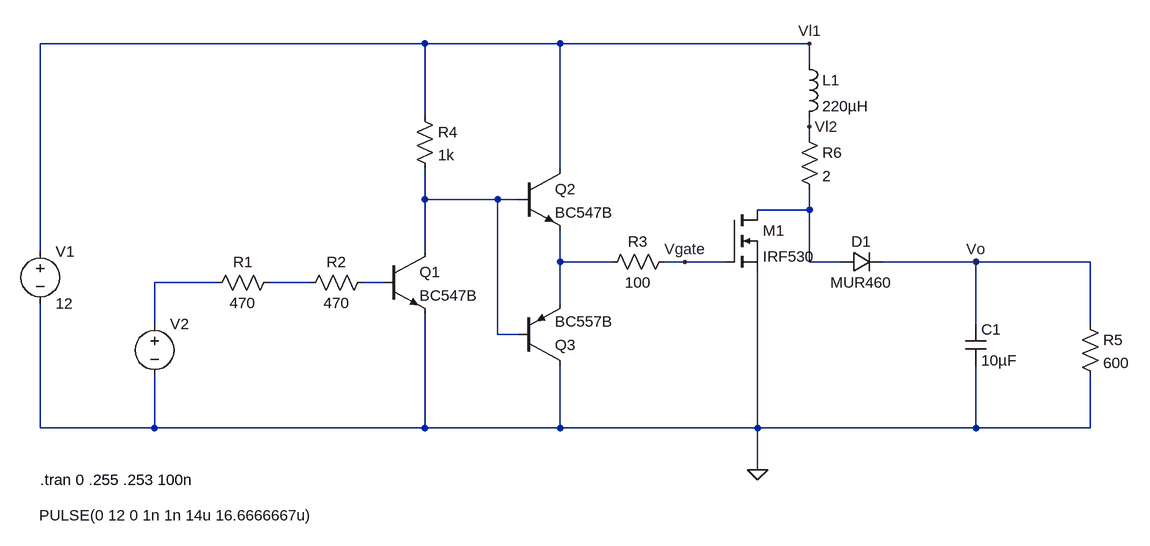
[diagram p0: schematic 4a.asc]
4a.asc, the LTspice schematic file:
Version 4
SHEET 1 1632 680
WIRE 544 -224 -48 -224
WIRE 752 -224 544 -224
WIRE 1136 -224 752 -224
WIRE 1136 -192 1136 -224
WIRE 544 -112 544 -224
WIRE 1136 -96 1136 -112
WIRE 1136 -80 1136 -96
WIRE 752 -32 752 -224
WIRE 544 16 544 -32
WIRE 656 16 544 16
WIRE 688 16 656 16
WIRE 1136 32 1136 0
WIRE 1136 32 1056 32
WIRE -48 96 -48 -224
WIRE 544 96 544 16
WIRE 752 112 752 64
WIRE 832 112 752 112
WIRE 944 112 912 112
WIRE 1008 112 944 112
WIRE 1136 112 1136 32
WIRE 1184 112 1136 112
WIRE 1392 112 1248 112
WIRE 1568 112 1392 112
WIRE 224 144 128 144
WIRE 368 144 304 144
WIRE 480 144 448 144
WIRE 752 176 752 112
WIRE 128 208 128 144
WIRE 1392 208 1392 112
WIRE 1568 208 1568 112
WIRE 656 224 656 16
WIRE 688 224 656 224
WIRE -48 368 -48 176
WIRE 128 368 128 288
WIRE 128 368 -48 368
WIRE 544 368 544 192
WIRE 544 368 128 368
WIRE 752 368 752 272
WIRE 752 368 544 368
WIRE 1056 368 1056 128
WIRE 1056 368 752 368
WIRE 1392 368 1392 272
WIRE 1392 368 1056 368
WIRE 1568 368 1568 288
WIRE 1568 368 1392 368
WIRE 1056 432 1056 368
FLAG 1056 432 0
FLAG 1392 112 Vo
FLAG 1136 -224 Vl1
FLAG 1136 -96 Vl2
FLAG 944 112 Vgate
SYMBOL voltage -48 80 R0
WINDOW 123 0 0 Left 0
WINDOW 39 0 0 Left 0
SYMATTR InstName V1
SYMATTR Value 12
SYMBOL voltage 128 192 R0
WINDOW 3 -178 310 Left 2
WINDOW 123 0 0 Left 0
WINDOW 39 0 0 Left 0
SYMATTR Value PULSE(0 12 0 1n 1n 14u 16.6666667u)
SYMATTR InstName V2
SYMBOL res 320 128 R90
WINDOW 0 0 56 VBottom 2
WINDOW 3 32 56 VTop 2
SYMATTR InstName R1
SYMATTR Value 470
SYMBOL res 464 128 R90
WINDOW 0 0 56 VBottom 2
WINDOW 3 32 56 VTop 2
SYMATTR InstName R2
SYMATTR Value 470
SYMBOL res 928 96 R90
WINDOW 0 0 56 VBottom 2
WINDOW 3 32 56 VTop 2
SYMATTR InstName R3
SYMATTR Value 100
SYMBOL res 528 -128 R0
SYMATTR InstName R4
SYMATTR Value 1k
SYMBOL res 1552 192 R0
SYMATTR InstName R5
SYMATTR Value 600
SYMBOL npn 480 96 R0
SYMATTR InstName Q1
SYMATTR Value BC547B
SYMBOL npn 688 -32 R0
SYMATTR InstName Q2
SYMATTR Value BC547B
SYMBOL pnp 688 272 M180
SYMATTR InstName Q3
SYMATTR Value BC557B
SYMBOL diode 1184 128 R270
WINDOW 0 32 32 VTop 2
WINDOW 3 0 32 VBottom 2
SYMATTR InstName D1
SYMATTR Value MUR460
SYMBOL cap 1376 208 R0
SYMATTR InstName C1
SYMATTR Value 10µF
SYMBOL res 1120 -96 R0
SYMATTR InstName R6
SYMATTR Value 2
SYMBOL ind 1120 -208 R0
SYMATTR InstName L1
SYMATTR Value 220µH
SYMBOL nmos 1008 32 R0
SYMATTR InstName M1
SYMATTR Value IRF530
TEXT -48 448 Left 2 !.tran 0 .255 .253 100n

The netlist it stands for:
* 4a.asc
V1 Vl1 0 12
V2 N004 0 PULSE(0 12 0 1n 1n 14u 16.6666667u)
R1 N005 N004 470
R2 N006 N005 470
R3 Vgate N003 100
R4 Vl1 N001 1k
R5 Vo 0 600
Q1 N001 N006 0 0 BC547B
Q2 Vl1 N001 N003 0 BC547B
Q3 0 N001 N003 0 BC557B
D1 N002 Vo MUR460
C1 Vo 0 10µF
R6 Vl2 N002 2
L1 Vl1 Vl2 220µH
M1 N002 Vgate 0 0 IRF530
.model D D
.lib standard.dio
.model NPN NPN
.model PNP PNP
.lib standard.bjt
.model NMOS NMOS
.model PMOS PMOS
.lib standard.mos
.tran 0 .255 .253 100n
.backanno
.end